# EasyEDA Pro project 2025智能物流搬运_PCB_XAUT_20250927.eprj, schematic Schematic14_2
Board Name: 电源板1.2B; Create Date: 2025-07-14; Page Name: P1; Project Name: 2025智能物流搬运_PCB_XAUT_20250921（替换降压）; Schematic Name: Schematic14_1; Update Date: 2025-09-21; Company: 嘉立创EDA; Page Size: A4; Version: V1.0
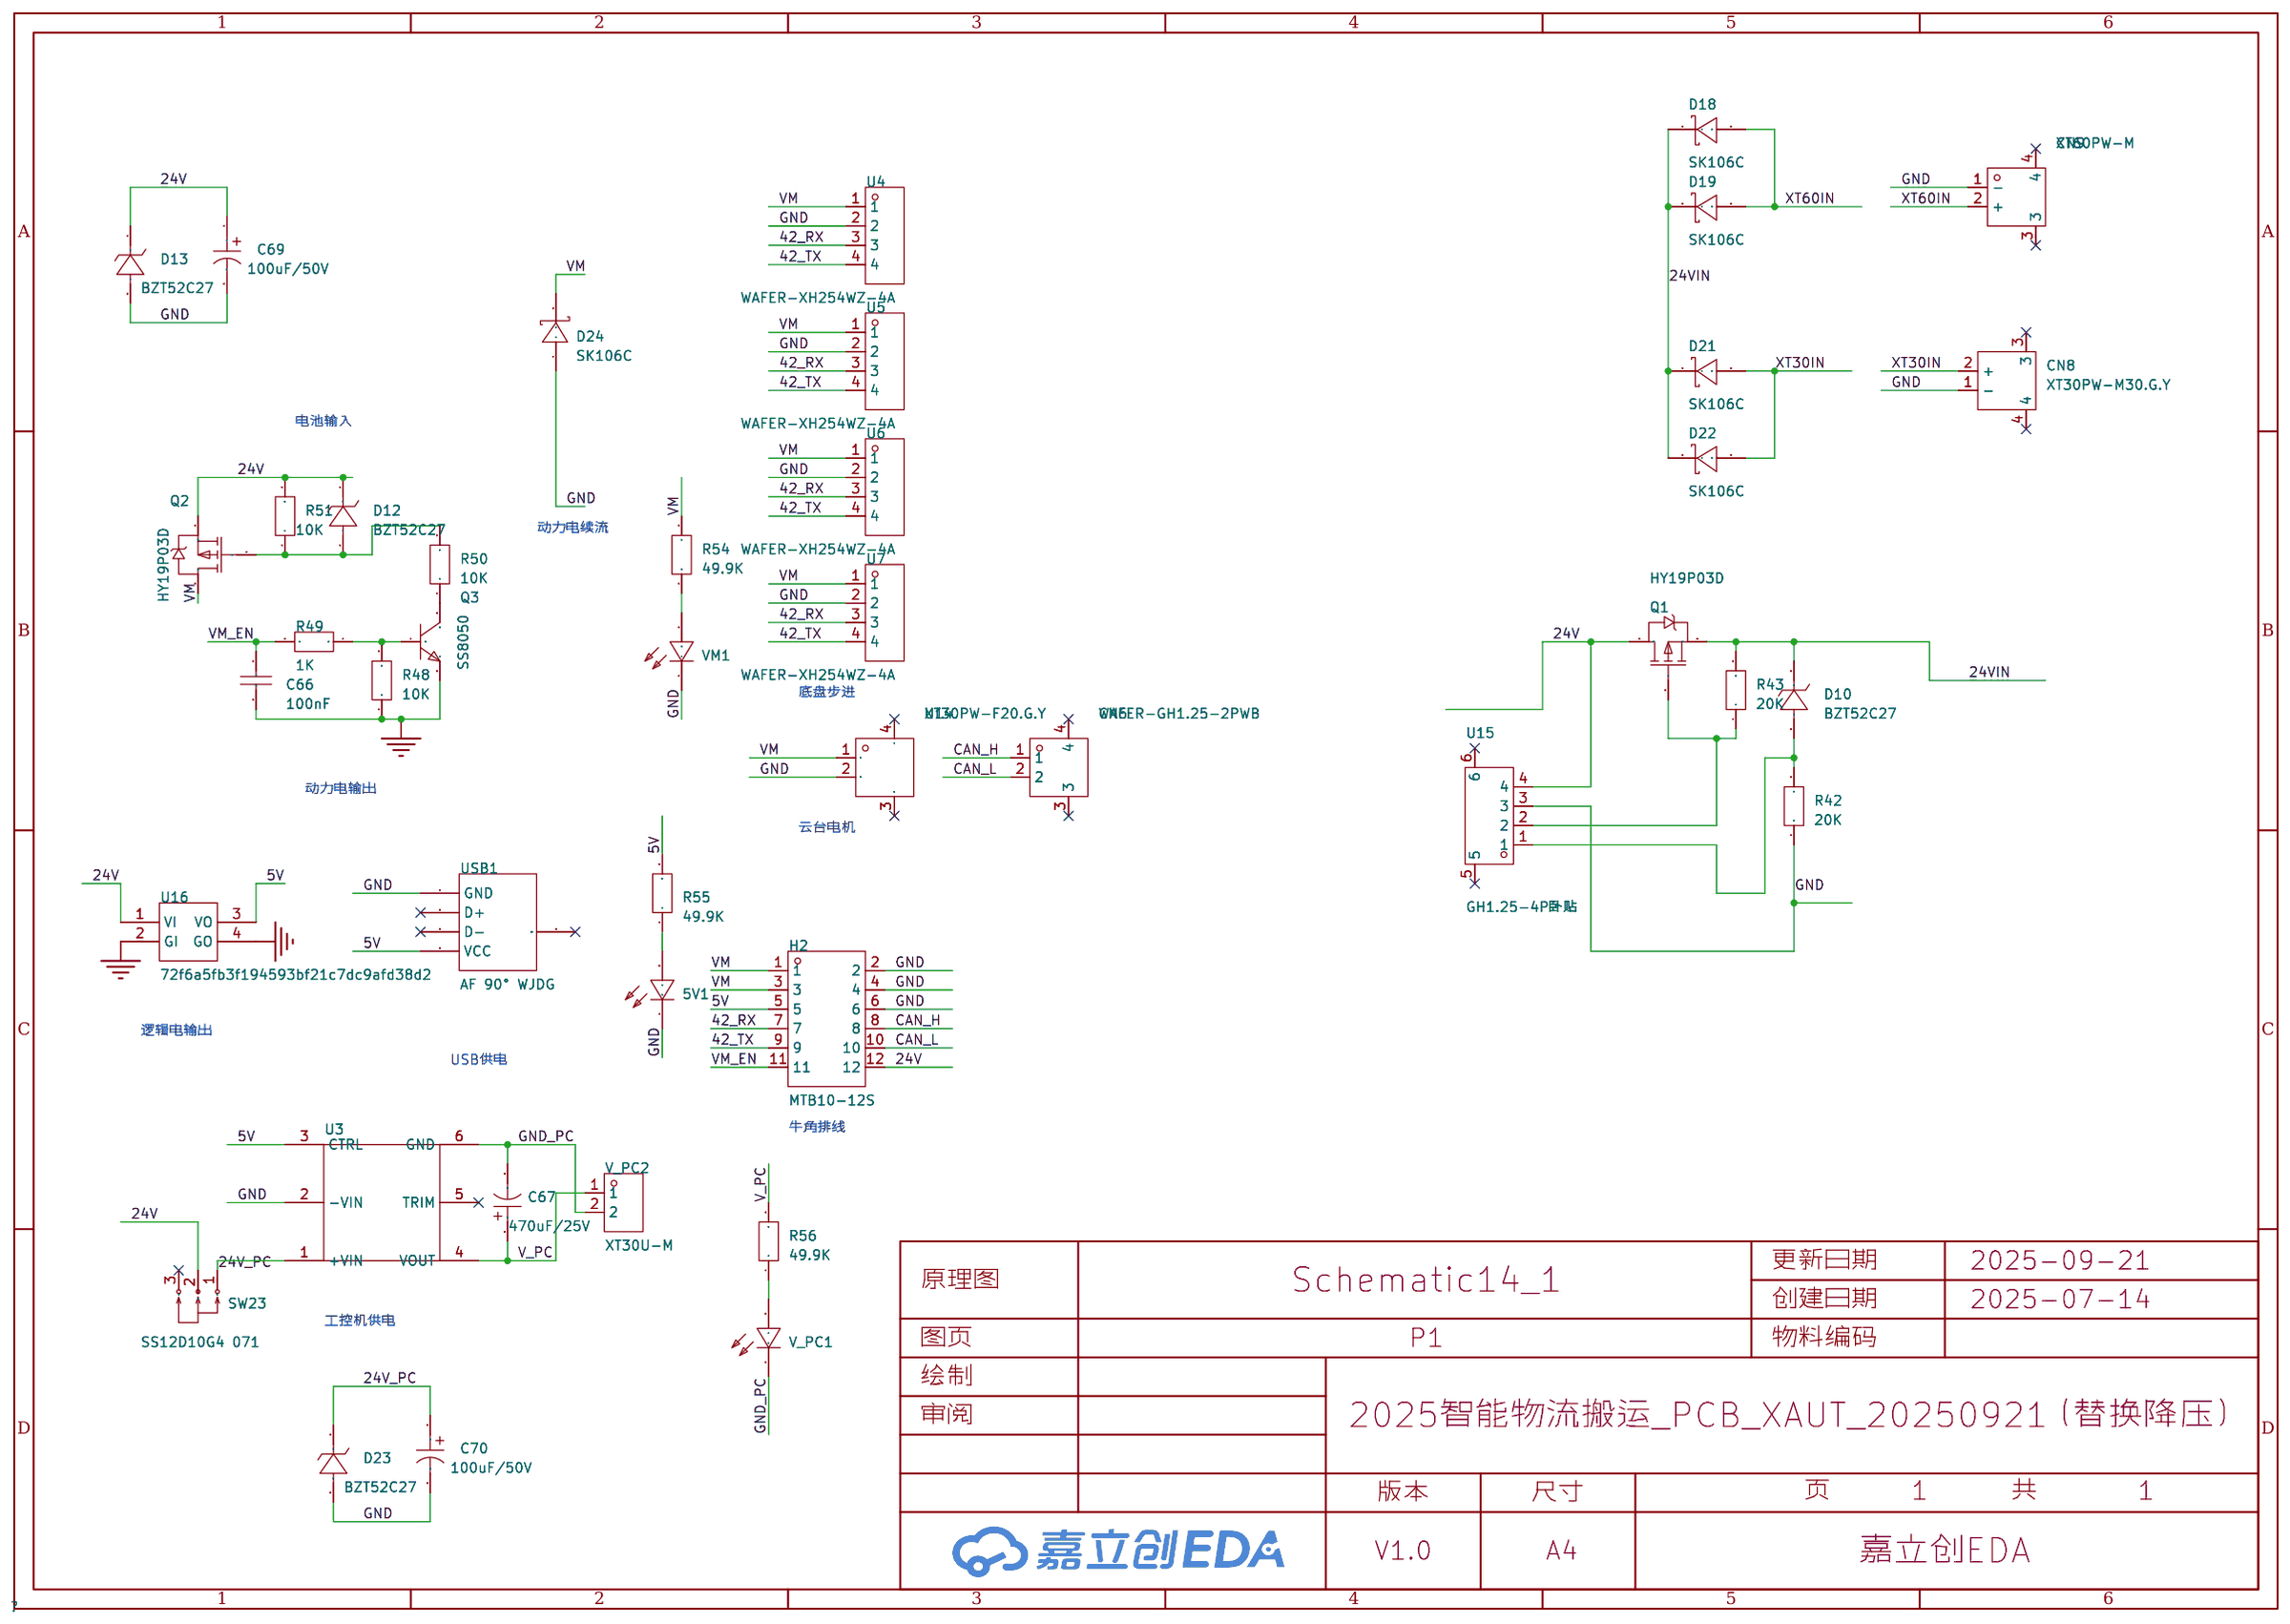
[diagram p11: schematic sheet]

## Parts
5V1  FC-DA1608HRK-620D  [LED0603-RD_RED]
C66  100nF  [C0603]
C67  470uF/25V  [CAP-TH_BD8.0-P3.50-D0.6-FD]
C69  100uF/50V  [CAP-TH_BD8.0-P3.50-D0.6-FD]
C70  100uF/50V  [CAP-TH_BD8.0-P3.50-D0.6-FD]
CN6  WAFER-GH1.25-2PWB  [CONN-TH_2P-P1.25_XUNPU_WAFER-GH1.25-2PWB]
CN8  XT30PW-M30.G.Y  [CONN-TH_XT30PW-M]
CN9  XT60PW-M  [CONN-TH_XT60PW-M]
D10  BZT52C27  [SOD-123_L2.7-W1.6-LS3.7-RD-1]
D12  BZT52C27  [SOD-123_L2.7-W1.6-LS3.7-RD-1]
D13  BZT52C27  [SOD-123_L2.7-W1.6-LS3.7-RD-1]
D18  SK106C  [SMC_L7.1-W6.2-LS8.1-R-RD]
D19  SK106C  [SMC_L7.1-W6.2-LS8.1-R-RD]
D21  SK106C  [SMC_L7.1-W6.2-LS8.1-R-RD]
D22  SK106C  [SMC_L7.1-W6.2-LS8.1-R-RD]
D23  BZT52C27  [SOD-123_L2.7-W1.6-LS3.7-RD-1]
D24  SK106C  [SMC_L7.1-W6.2-LS8.1-R-RD]
H2  MTB10-12S  [CONN-TH_12P-P2.54_MTB10-12S]
Q1  HY19P03D  [TO-252-2_L6.6-W6.1-P4.57-LS9.9-TL-CW]
Q2  HY19P03D  [TO-252-2_L6.6-W6.1-P4.57-LS9.9-TL-CW]
Q3  SS8050  [SOT-23-3_L2.9-W1.3-P1.90-LS2.4-BR]
R42  20K  [R0603]
R43  20K  [R0603]
R48  10K  [R0603]
R49  1K  [R0603]
R50  10K  [R0603]
R51  10K  [R0603]
R54  49.9K  [R0603]
R55  49.9K  [R0603]
R56  49.9K  [R0603]
SW23  SS12D10G4 071  [SW-TH_SHOU-HAN_SS12D10G4]
U3  -  [隔离电源]
U4  WAFER-XH254WZ-4A  [conn-th_4p-p2.50_wafer-xh254wz-4a]
U5  WAFER-XH254WZ-4A  [conn-th_4p-p2.50_wafer-xh254wz-4a]
U6  WAFER-XH254WZ-4A  [conn-th_4p-p2.50_wafer-xh254wz-4a]
U7  WAFER-XH254WZ-4A  [conn-th_4p-p2.50_wafer-xh254wz-4a]
U14  XT30PW-F20.G.Y  [CONN-TH_XT30PW-F-1]
U15  GH1.25-4P卧贴  [CONN-SMD_4P-P1.25_GH1.25-4P]
U16  72f6a5fb3f194593bf21c7dc9afd38d2  [5V降压模块_17.5*12]
USB1  AF 90° WJDG  [USB-A-TH_AF-WJDG]
V_PC1  FC-DA1608HRK-620D  [LED0603-RD_RED]
V_PC2  XT30U-M  [CONN-TH_XT30U-M]
VM1  FC-DA1608HRK-620D  [LED0603-RD_RED]

## Library data of the parts
5V1 V_PC1 VM1 = FC-DA1608HRK-620D: link: https://item.szlcsc.com/221679.html; Supplier: LCSC; Manufacturer: 国星光电; Manufacturer Part: NCD0603R1; Supplier Part: C84263; JLCPCB Part Class: Extended Part
C66 = 100nF: link: https://item.szlcsc.com/362304.html; 3DModel: C0603_L1.6-W0.8-H0.8; Supplier: LCSC; Manufacturer: FH(风华); Manufacturer Part: 0603B104K500NT; Supplier Part: C30926; JLCPCB Part Class: Extended Part
C67 C69 C70 = 100uF/50V: Supplier Part: C9900004739; Supplier Footprint: 1CAP-TH_BD8.0-P3.50-D0.6-FD; JLCPCB Part Class: 扩展库; Supplier: LCSC
CN6 = WAFER-GH1.25-2PWB: LCSC Part Name: 1x2P 间距:1.25mm 卧贴 系列:GH; Supplier Part: C3029377; Manufacturer: XUNPU(讯普); Supplier Footprint: SMD,P=1.25mm,卧贴; Datasheet: https://atta.szlcsc.com/upload/public/pdf/source/20220527/CB8773BFB0913C3B8ABD62CB38BA101A.pdf; Supplier: LCSC; Pins Structure: 1x2P; Pitch: 1.25mm; Mounting Style: 卧贴; Reference Series: GH; Number of Pins: 2P; Number of Rows: 1; Number of PINs Per Row: 2; Current Rating (Max): 1A; Operating Temperature Range: -25℃~+85℃
CN8 = XT30PW-M30.G.Y: LCSC Part Name: AMASS(艾迈斯)航模插头 卧式弯脚 XT30PW-M公头; Supplier Part: C431092; Manufacturer: AMASS(艾迈斯); JLCPCB Part Class: 扩展库; Datasheet: https://atta.szlcsc.com/upload/public/pdf/source/20220222/6A9F22F7850E25B33E1BE430ADF8560B.pdf; Supplier: LCSC; Type: 航模插头; RatedVoltage: DC 500V; InterfaceType: 公头; RatedCurrent: 15A; RecommendedWireGauge: 16/18/20AWG; contact resistance: 1.2mΩ; specifications: 2pin
CN9 = XT60PW-M: LCSC Part Name: AMASS(艾迈斯)航模插头xt60连接器150公母对接pw锂电池公头 板插卧式XT60PW-M; Supplier Part: C98732; Manufacturer: AMASS(艾迈斯); JLCPCB Part Class: 扩展库; Datasheet: https://atta.szlcsc.com/upload/public/pdf/source/20240118/44A3DCFF53BE25DC65378AFFB21277A4.pdf; Supplier: LCSC; Brand: 艾迈斯; Type: 卧式插头; Colour: 黄色; InterfaceType: 公头
D10 D12 D13 D23 = BZT52C27: Supplier Part: C707150; Manufacturer: Slkor(萨科微); Supplier Footprint: SOD-123; JLCPCB Part Class: 扩展库; Datasheet: https://atta.szlcsc.com/upload/public/pdf/source/20200721/C707125_BAEA70ACC1B0F60BBAC1FD71D8806D24.pdf; Supplier: LCSC; Reverse Leakage Current (Ir): 100nA@18.9V; Power Dissipation: 500mW
D18 D19 D21 D22 D24 = SK106C: LCSC Part Name: 电压:60V 电流:10A; Supplier Part: C65019; Manufacturer: MDD(辰达半导体); Supplier Footprint: SMC(DO-214AB); JLCPCB Part Class: 扩展库; Datasheet: https://atta.szlcsc.com/upload/public/pdf/source/20240809/67CB7568232D64DFC630C382DB2ED9F9.pdf; Supplier: LCSC; Diode Configuration: 独立式; Forward Voltage (Vf@If): 650mV@10A; Reverse Voltage (Vr): 60V; Rectified Current: 10A; Reverse Leakage Current (Ir): 1mA@60V
H2 = MTB10-12S: Supplier Part: C3148238; Manufacturer: MINTRON(明硕); Supplier Footprint: 插件,P=2.54mm; Datasheet: https://atta.szlcsc.com/upload/public/pdf/source/20220705/35161231C53940228D3017974FD3B995.pdf; Supplier: LCSC; Holder Type: 直插
Q1 Q2 = HY19P03D: LCSC Part Name: P沟道 耐压:30V 电流:90A; Supplier Part: C122492; Manufacturer: HUAYI(华羿微); Supplier Footprint: TO-252-2; JLCPCB Part Class: 扩展库; Datasheet: https://atta.szlcsc.com/upload/public/pdf/source/20170728/C122492_1501225751911848809.pdf; Supplier: LCSC; Type: P沟道; Drain Source Voltage (Vdss): 30V; Continuous Drain Current (Id): 90A; Power Dissipation (Pd): 50W; Drain Source On Resistance (RDS(on)@Vgs,Id): 6mΩ@10V,45A; Gate Threshold Voltage (Vgs(th)@Id): 3V@250uA
Q3 = SS8050_C2150: LCSC Part Name: SS8050(RANGE:200-350) hfe=200~350; Supplier Part: C2150; Manufacturer: CJ(江苏长电/长晶); Supplier Footprint: SOT-23; JLCPCB Part Class: 基础库; Datasheet: https://atta.szlcsc.com/upload/public/pdf/source/20230322/AEE86F4B043774EFF80CAEA14A37D9E9.pdf; Supplier: LCSC; Transistor Type: NPN; Collector Current (Ic): 1.5A; Collector-Emitter Breakdown Voltage (Vceo): 25V; Power Dissipation (Pd): 300mW; DC Current Gain (hFE@Ic,Vce): 200@100mA,1V; Transition Frequency (fT): 100MHz; Collector Cut-Off Current (Icbo): 100nA; Collector-Emitter Saturation Voltage (VCE(sat)@Ic,Ib): 500mV@800mA,80mA
R42 R43 R48-R51 R54-R56 = 10K: 3DModel: R0603_L1.6-W0.8-H0.8; link: https://www.mouser.in/datasheet/2/447/PYu_RT_1_to_0_01_RoHS_L_11-1669912.pdf
SW23 = SS12D10G4 071: 立式两档拨动,单排3脚插件,12.7x6.7x6.4,黑柄4MM; Supplier Part: C2887259; Manufacturer: SHOU HAN(首韩); Supplier Footprint: 插件; JLCPCB Part Class: Extended Part; Datasheet: https://atta.szlcsc.com/upload/public/pdf/source/20210820/80D1704BBF3FCEE0435FCAA54C61E0A3.pdf; Supplier: LCSC
U3 = 隔离电源
U4-U7 = WAFER-XH254WZ-4A: Supplier Part: C7432693; Manufacturer: HANBO(汉博); Supplier Footprint: 插件,P=2.5mm; Datasheet: https://atta.szlcsc.com/upload/public/pdf/source/20230721/127D646758C1D4B76FEF9901992220E1.pdf; Supplier: LCSC; Pins Structure: 1x4P; Pitch: 2.54mm; Mounting Style: 弯插; Reference Series: XH; Number of Pins: 4P; Number of Rows: 1; Number of PINs Per Row: 4; Current Rating (Max): 3A; Operating Temperature Range: -25℃~+85℃
U14 = XT30PW-F20.G.Y: LCSC Part Name: AMASS(艾迈斯)电源连接器 母头 XT30PW-F; Supplier Part: C2913282; Manufacturer: AMASS(艾迈斯); JLCPCB Part Class: 扩展库; Datasheet: https://atta.szlcsc.com/upload/public/pdf/source/20231218/06CFCF98887A9A87638B0856A725C8FD.pdf; Supplier: LCSC; Type: 航模插头; InterfaceType: 母头
U15 = GH1.25-4P卧贴: Supplier Part: C9900014670; JLCPCB Part Class: 扩展库; Supplier: LCSC
U16 = 5V降压模块_17.5*12
USB1 = AF 90° WJDG: LCSC Part Name: Type-A 母 弯插; Supplier Part: C456018; Manufacturer: SHOU HAN(首韩); Supplier Footprint: 插件; Datasheet: https://atta.szlcsc.com/upload/public/pdf/source/20191113/C456018_B104E062BEB8E11E57E63560E04EE13A.pdf; Supplier: LCSC; Connector Type: Type-A; Standard: USB 2.0; Gender: 母; Number of Ports: 1; Number of Contacts: 4P; Mounting Style: 弯插; Current Rating - Power (Max): 1.5A; Operating Temperature Range: -25℃~+85℃
V_PC2 = XT30U-M: 模型插头轻量版锂电池插头; LCSC Part Name: AMASS(艾迈斯)轻量版锂电池插头公头 XT30U-M; Supplier Part: C99101; Manufacturer: AMASS(艾迈斯); JLCPCB Part Class: 扩展库; Datasheet: https://atta.szlcsc.com/upload/public/pdf/source/20170606/1496716542582.pdf; Supplier: LCSC

## Nets
5V: H2.5 R55.2 U3.3(CTRL) U16.3(VO) USB1.1(VCC)
24V: C69.1 D12.1(K) D13.1(K) H2.12 Q1.2(D) Q2.3(S) R51.2 SW23.2 U15.4 U16.1(VI)
24V_PC: C70.1 D23.1(K) SW23.1 U3.1(+VIN)
24VIN: D10.1(K) D18.2(K) D19.2(K) D21.2(K) D22.2(K) Q1.3(S) R43.2
GND: 5V1.1(K) C66.1 C69.2 C70.2 CN8.1(-) CN9.1(-) D13.2(A) D23.2(A) D24.1(A) H2.2 H2.4 H2.6 Q3.2(E) R42.1 R48.1 U3.2(-VIN) U4.2 U5.2 U6.2 U7.2 U14.2 U15.3 U16.2(GI) U16.4(GO) USB1.4(GND) VM1.1(K)
GND_PC: C67.2 U3.6(GND) V_PC1.1(K) V_PC2.2
42_RX: H2.7 U4.3 U5.3 U6.3 U7.3
42_TX: H2.9 U4.4 U5.4 U6.4 U7.4
CAN_H: CN6.1 H2.8
CAN_L: CN6.2 H2.10
V_PC: C67.1 R56.2 U3.4(VOUT) V_PC2.1
VM: D24.2(K) H2.1 H2.3 Q2.2(D) R54.2 U4.1 U5.1 U6.1 U7.1 U14.1
VM_EN: C66.2 H2.11 R49.2
XT30IN: CN8.2(+) D21.1(A) D22.1(A)
XT60IN: CN9.2(+) D18.1(A) D19.1(A)
$1N1666: D12.2(A) Q2.1(G) R50.2 R51.1
$1N1689: Q3.3(C) R50.1
$1N1693: Q3.1(B) R48.2 R49.1
$1N1710: 5V1.2(A) R55.1
$1N1735: R54.1 VM1.2(A)
$1N1739: D10.2(A) R42.2 U15.1
$1N1742: Q1.1(G) R43.1 U15.2
$1N1769: R56.1 V_PC1.2(A)

Not connected (* = marked no-connect by the designer): CN6 3* 4*; CN8 3* 4*; CN9 3* 4*; SW23 3*; U3 5(TRIM)*; U14 3* 4*; U15 5* 6*; USB1 2(D-)* 3(D+)* 5(SHLD)*

## Notes on the sheet
- 电池输入
- 动力电续流
- 底盘步进
- 动力电输出
- 云台电机
- 逻辑电输出
- USB供电
- 牛角排线
- 工控机供电
